# Altium project BQ79616-Q1_BMS_Slave.PrjPcb (part 2 of 2)

## Sheet Connectors.SchDoc
size A4; SheetNumber: 8; SheetTotal: 8
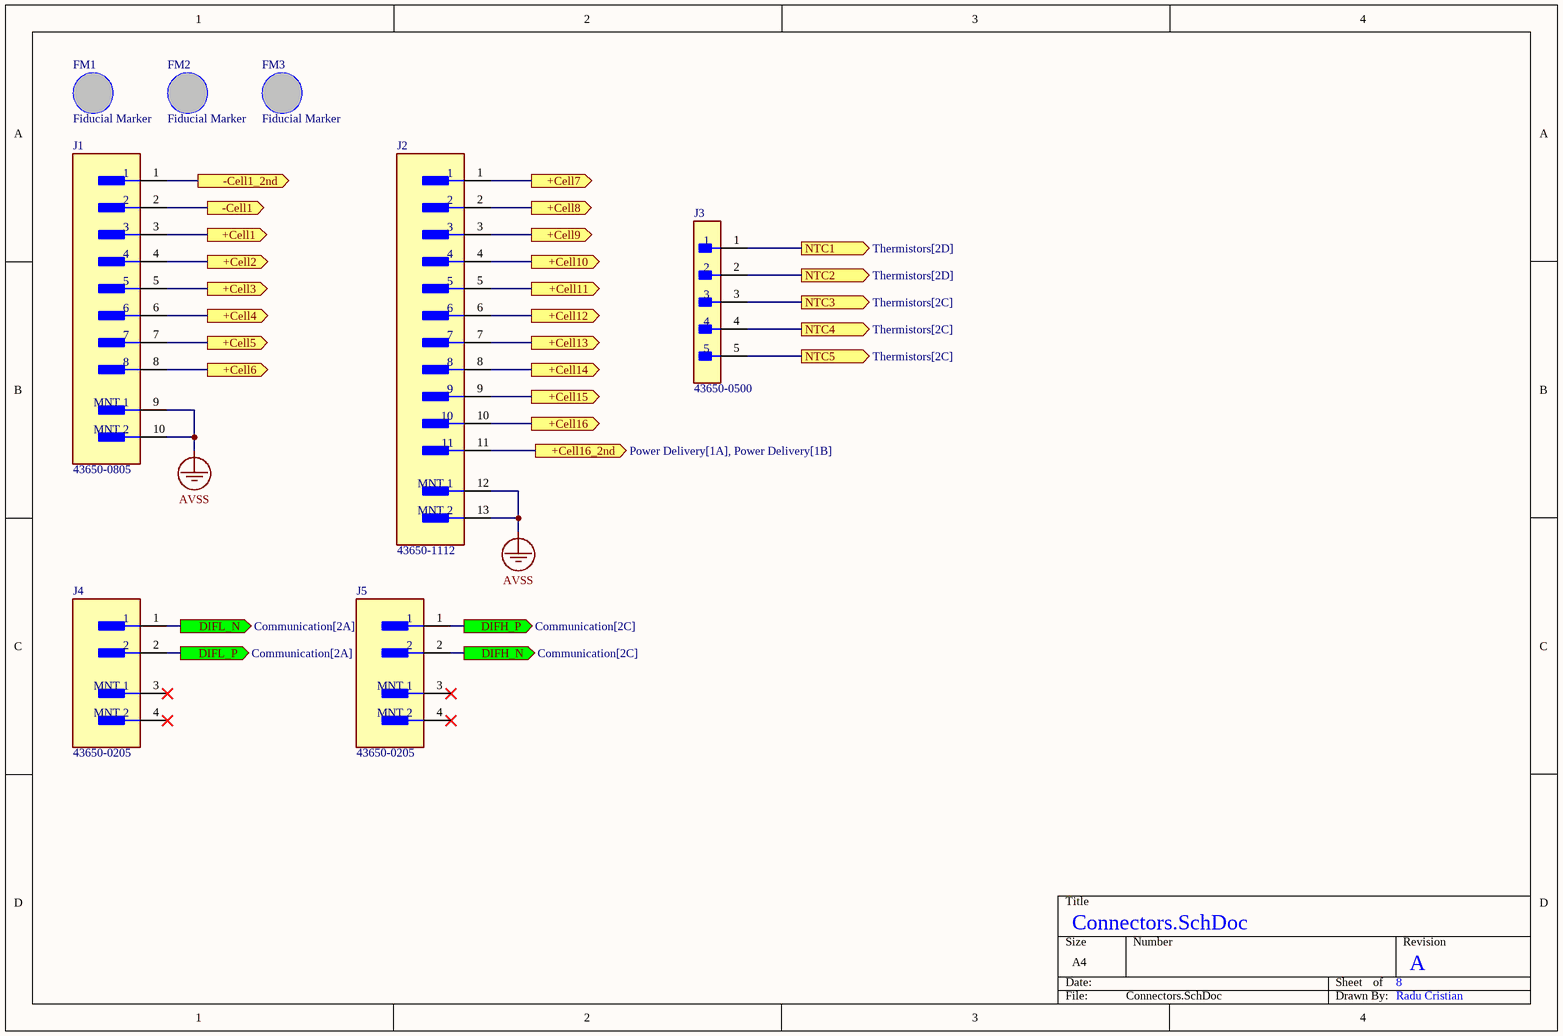
[diagram p7: Connectors.SchDoc]

### Parts
FM1  Fiducial Marker  [Fiducial Marker-Footprint-1]
FM2  Fiducial Marker  [Fiducial Marker-Footprint-1]
FM3  Fiducial Marker  [Fiducial Marker-Footprint-1]
J1  43650-0805  [FP-436500805-MFG]
J2  43650-1112  [FP-43650-1112-MFG]
J3  43650-0500  [FP-43650-0500-MFG]
J4  43650-0205  [FP-43650-0205-MFG]
J5  43650-0205  [FP-43650-0205-MFG]

### Ports
+Cell1 (out, see Cell Balancing[1D], Cell Voltage Sensing[1D]), +Cell2 (out, see Cell Balancing[1D], Cell Voltage Sensing[1D]), +Cell3 (out, see Cell Balancing[1C], Cell Voltage Sensing[1D]), +Cell4 (out, see Cell Balancing[1C], Cell Voltage Sensing[1C]), +Cell5 (out, see Cell Balancing[1C], Cell Voltage Sensing[1C]), +Cell6 (out, see Cell Balancing[1C], Cell Voltage Sensing[1C]), +Cell7 (out, see Cell Balancing[1C], Cell Voltage Sensing[1C]), +Cell8 (out, see Cell Balancing[1C], Cell Voltage Sensing[1C]), +Cell9 (out, see Cell Balancing[1B], Cell Voltage Sensing[1C]), +Cell10 (out, see Cell Balancing[1B], Cell Voltage Sensing[1B]), +Cell11 (out, see Cell Balancing[1B], Cell Voltage Sensing[1B]), +Cell12 (out, see Cell Balancing[1B], Cell Voltage Sensing[1B]), +Cell13 (out, see Cell Balancing[1B], Cell Voltage Sensing[1B]), +Cell14 (out, see Cell Balancing[1B], Cell Voltage Sensing[1B]), +Cell15 (out, see Cell Balancing[1B], Cell Voltage Sensing[1B]), +Cell16 (out, see Cell Balancing[1A], Cell Voltage Sensing[1B]), +Cell16_2nd (out, see Power Delivery[1A], Power Delivery[1B]), -Cell1 (out, see Cell Balancing[1D], Cell Voltage Sensing[1D]), -Cell1_2nd (out, see Power Delivery[2A]), DIFH_N (out, see Communication[2C]), DIFH_P (out, see Communication[2C]), DIFL_N (out, see Communication[2A]), DIFL_P (out, see Communication[2A]), NTC1 (out, see Thermistors[2D]), NTC2 (out, see Thermistors[2D]), NTC3 (out, see Thermistors[2C]), NTC4 (out, see Thermistors[2C]), NTC5 (out, see Thermistors[2C])

### Nets
AVSS: J1.1 J1.9(MNT_1) J1.10(MNT_2) J2.12(MNT_1) J2.13(MNT_2) ; port -Cell1_2nd
+Cell1: J1.3 ; port +Cell1
+Cell2: J1.4 ; port +Cell2
+Cell3: J1.5 ; port +Cell3
+Cell4: J1.6 ; port +Cell4
+Cell5: J1.7 ; port +Cell5
+Cell6: J1.8 ; port +Cell6
+Cell7: J2.1 ; port +Cell7
+Cell8: J2.2 ; port +Cell8
+Cell9: J2.3 ; port +Cell9
+Cell10: J2.4 ; port +Cell10
+Cell11: J2.5 ; port +Cell11
+Cell12: J2.6 ; port +Cell12
+Cell13: J2.7 ; port +Cell13
+Cell14: J2.8 ; port +Cell14
+Cell15: J2.9 ; port +Cell15
+Cell16: J2.10 ; port +Cell16
+Cell16_2nd: J2.11 ; port +Cell16_2nd
-Cell1: J1.2 ; port -Cell1
DIFH_N: J5.2 ; port DIFH_N
DIFH_P: J5.1 ; port DIFH_P
DIFL_N: J4.1 ; port DIFL_N
DIFL_P: J4.2 ; port DIFL_P
NTC1: J3.1 ; port NTC1
NTC2: J3.2 ; port NTC2
NTC3: J3.3 ; port NTC3
NTC4: J3.4 ; port NTC4
NTC5: J3.5 ; port NTC5

Not connected (* = marked no-connect by the designer): J4 3(MNT_1)* 4(MNT_2)*; J5 3(MNT_1)* 4(MNT_2)*

### Notes on the sheet
- Radu Cristian

### Library data of the parts
FM1-FM3 = CMP-00003-4: fancy style
J1 = CMP-002-00071-1: Header Connector, pcb Mount, recept, 8 Contacts, pin, 0.118 Pitch, pc Tail Terminal; Connector Type: Male Pin; Voltage Rating: 600V; Pins: 8; Max Operating Temperature: 105°C; Mounting Technology: Through Hole; Min Operating Temperature: -40°C
J2 = CMP-00257-00277522-1: 43650-1112 Conn Power HDR 11 POS 3mm Solder RA SMD 11 Terminal 1 Port Micro-Fit 3.0™ Embossed T/R; NexarPartId: 277522; Manufacturer Lifecycle Status: ACTIVE; Plating: Tin; Number of Circuits: 11; Connector Type: Male Pin; Gender: Male; Voltage Rating (DC): 250V; Voltage Rating: 600V; Glow Wire Compliant: Compliant; Current Rating: 5A; Orientation: Right Angle; Country of Origin: US; Lead Pitch: 3mm; Flammability Rating: UL94 V-0; Contact Material: Brass; Max Operating Temperature: 105°C; Min Operating Temperature: -40°C; Number of Contacts: 11; Number of Positions: 11; Pitch: 3mm; Housing Material: Polymer; Lifecycle Status: Production; Fastening Type: Ramp; Termination: Solder; RoHS: Compliant; Contact Gender: Male; Halogen Free: Low Halogen; Color: Black; Contact Plating: Tin; Number of Rows: 1; Lead Free: Contains Lead; Mount: Surface Mount; Housing Color: Black
J3 = CMP-04776-000912-1: CONN HEADER R/A 5POS 3MM; Manufacturer Series: 43650; Contact Resistance: 10mR; MIL Conformance: No; Number of Terminals/Pins: 5; Number of Rows Loaded: 1; Gender: Male; Current Rating: 5A; Option: General Purpose; Voltage Rating: 600V; Voltage Rating (DC): 250V; Glow Wire Compliant: Compliant; Additional Feature: POLARIZED; Contact Gender: Male; Mount: Through Hole; Series: 43650; Housing Material: Thermoplastic; Contact Material: Brass; Mixed Contacts: No; Max Operating Temperature: 105°C; Orientation: Right Angle; Package Quantity: 2023; Number of Rows: 1; Color: Black; Flammability Rating: UL94 V-0; Length: 18.65mm; Lead Free: Contains Lead; Housing Color: Black; Number of Circuits: 5; Number of Ports: 1; Mounting Style: RIGHT ANGLE; Radiation Hardening: No; IEC Conformance: No; Depth: 9.9mm; Min Operating Temperature: -40°C; Number of Contacts: 5; DIN Conformance: No; Filter Feature: No; Packaging: Tray; Contact Plating: Tin; RoHS Compliant: Yes; Number of Positions: 5; Halogen Free: Low Halogen; Termination: Solder; Pitch: 3mm
J4 J5 = CMP-00257-07672643-1: 43650-0205 Conn Wire to Board HDR 2 POS 3mm Solder RA Side Entry Thru-Hole Micro-Fit 3.0™ Tray; Manufacturer Lifecycle Status: ACTIVE; Plating: Tin; Glow Wire Compliant: Compliant; Number of Contacts: 2; Gender: Male; Voltage Rating: 600V; Current Rating: 5A; Lifecycle Status: Production; RoHS: Compliant; Number of Rows: 1; Housing Material: Thermoplastic; Country of Origin: US; Number of Circuits: 2; Halogen Free: Low Halogen; Orientation: Right Angle; Termination: Through Hole; Pitch: 3mm; Contact Material: Brass; Contact Plating: Gold; NexarPartId: 7672643; Number of Positions: 2

## Nets that join several sheets
AVSS: BQ chip (7 pins), Power Delivery (C4.1 C5.2 D2.1), Thermistors (17 pins), Communication (R69.1 R70.1), Connectors (5 pins)
BAT: BQ chip (IC1.1), Power Delivery (C4.2 R2.1), Cell Balancing (C7.2), Cell Voltage Sensing (C21.2)
CVDD: BQ chip (C2.1 IC1.45 IC1.52), Power Delivery (R5.2)
CVSS: BQ chip (C2.2 IC1.46), Power Delivery (C6.1), Communication (7 pins)
DVSS: BQ chip (C1.1 IC1.50), Communication (R70.2)
+Cell1: Cell Balancing (R18.2), Cell Voltage Sensing (R32.2), Connectors (J1.3)
+Cell2: Cell Balancing (R17.2), Cell Voltage Sensing (R31.2), Connectors (J1.4)
+Cell3: Cell Balancing (R16.2), Cell Voltage Sensing (R30.2), Connectors (J1.5)
+Cell4: Cell Balancing (R15.2), Cell Voltage Sensing (R29.2), Connectors (J1.6)
+Cell5: Cell Balancing (R14.2), Cell Voltage Sensing (R28.2), Connectors (J1.7)
+Cell6: Cell Balancing (R13.2), Cell Voltage Sensing (JMP*31.1 R27.2), Connectors (J1.8)
+Cell7: Cell Balancing (R12.2), Cell Voltage Sensing (JMP*29.1 JMP*31.2 R26.2), Connectors (J2.1)
+Cell8: Cell Balancing (R11.2), Cell Voltage Sensing (JMP*13.1 JMP*29.2 R25.2), Connectors (J2.2)
+Cell9: Cell Balancing (R10.2), Cell Voltage Sensing (JMP*11.1 JMP*13.2 R24.2), Connectors (J2.3)
+Cell10: Cell Balancing (R9.2), Cell Voltage Sensing (JMP*9.1 JMP*11.2 R23.2), Connectors (J2.4)
+Cell11: Cell Balancing (R8.2), Cell Voltage Sensing (JMP*7.1 JMP*9.2 R22.2), Connectors (J2.5)
+Cell12: Cell Balancing (R7.2), Cell Voltage Sensing (JMP*5.1 JMP*7.2 R21.2), Connectors (J2.6)
+Cell13: Cell Balancing (R6.2), Cell Voltage Sensing (JMP*5.2 JMP*27.1 R20.2), Connectors (J2.7)
+Cell14: Cell Balancing (R65.2), Cell Voltage Sensing (JMP*25.1 JMP*27.2 R68.2), Connectors (J2.8)
+Cell15: Cell Balancing (R64.2), Cell Voltage Sensing (JMP*23.1 JMP*25.2 R67.2), Connectors (J2.9)
+Cell16: Cell Balancing (R63.2), Cell Voltage Sensing (JMP*23.2 R66.2), Connectors (J2.10)
+Cell16_2nd: Power Delivery (R2.2 R3.1), Connectors (J2.11)
-Cell1: Cell Balancing (R19.2), Cell Voltage Sensing (R33.2), Connectors (J1.2)
CB0: BQ chip (IC1.34), Cell Balancing (C20.1 R19.1)
CB1: BQ chip (IC1.32), Cell Balancing (C19.1 C20.2 R18.1)
CB2: BQ chip (IC1.30), Cell Balancing (C18.1 C19.2 R17.1)
CB3: BQ chip (IC1.28), Cell Balancing (C17.1 C18.2 R16.1)
CB4: BQ chip (IC1.26), Cell Balancing (C16.1 C17.2 R15.1)
CB5: BQ chip (IC1.24), Cell Balancing (C15.1 C16.2 R14.1)
CB6: BQ chip (IC1.22), Cell Balancing (C14.1 C15.2 JMP*19.1 R13.1)
CB7: BQ chip (IC1.20), Cell Balancing (5 pins)
CB8: BQ chip (IC1.18), Cell Balancing (5 pins)
CB9: BQ chip (IC1.16), Cell Balancing (5 pins)
CB10: BQ chip (IC1.14), Cell Balancing (5 pins)
CB11: BQ chip (IC1.12), Cell Balancing (5 pins)
CB12: BQ chip (IC1.10), Cell Balancing (5 pins)
CB13: BQ chip (IC1.8), Cell Balancing (5 pins)
CB14: BQ chip (IC1.6), Cell Balancing (5 pins)
CB15: BQ chip (IC1.4), Cell Balancing (5 pins)
CB16: BQ chip (IC1.2), Cell Balancing (C7.1 C51.2 JMP*15.2 R63.1)
COMH_N: BQ chip (IC1.42), Communication (C49.2 R61.2 R62.1)
COMH_P: BQ chip (IC1.43), Communication (C48.1 R60.1 R61.1)
COML_N: BQ chip (IC1.41), Communication (C44.1 R57.1 R58.1)
COML_P: BQ chip (IC1.40), Communication (C45.2 R58.2 R59.1)
DIFH_N: Communication (L2.3), Connectors (J5.2)
DIFH_P: Communication (L2.4), Connectors (J5.1)
DIFL_N: Communication (L1.4), Connectors (J4.1)
DIFL_P: Communication (L1.3), Connectors (J4.2)
GPIO1: BQ chip (IC1.61), Thermistors (C42.1 R51.2)
GPIO2: BQ chip (IC1.60), Thermistors (C41.1 R50.2)
GPIO3: BQ chip (IC1.59), Thermistors (C40.1 R49.2)
GPIO4: BQ chip (IC1.58), Thermistors (C39.1 R48.2)
GPIO5: BQ chip (IC1.57), Thermistors (C38.1 R47.2)
GPIO6: BQ chip (IC1.56), Thermistors (C37.1 R37.2)
GPIO7: BQ chip (IC1.55), Thermistors (C36.1 R36.2)
LDOIN: BQ chip (IC1.47), Power Delivery (C6.2 Q1.3)
NPNB: BQ chip (IC1.48), Power Delivery (Q1.1)
NTC1: Thermistors (R46.1 R51.1 R56.2), Connectors (J3.1)
NTC2: Thermistors (R45.1 R50.1 R55.2), Connectors (J3.2)
NTC3: Thermistors (R44.1 R49.1 R54.2), Connectors (J3.3)
NTC4: Thermistors (R43.1 R48.1 R53.2), Connectors (J3.4)
NTC5: Thermistors (R42.1 R47.1 R52.2), Connectors (J3.5)
TSREF: BQ chip (IC1.51), Thermistors (8 pins)
VC0: BQ chip (IC1.35), Cell Voltage Sensing (C34.1 R33.1)
VC1: BQ chip (IC1.33), Cell Voltage Sensing (C33.1 C34.2 R32.1)
VC2: BQ chip (IC1.31), Cell Voltage Sensing (C32.1 C33.2 R31.1)
VC3: BQ chip (IC1.29), Cell Voltage Sensing (C31.1 C32.2 R30.1)
VC4: BQ chip (IC1.27), Cell Voltage Sensing (C30.1 C31.2 R29.1)
VC5: BQ chip (IC1.25), Cell Voltage Sensing (C29.1 C30.2 R28.1)
VC6: BQ chip (IC1.23), Cell Voltage Sensing (C28.1 C29.2 JMP*32.1 R27.1)
VC7: BQ chip (IC1.21), Cell Voltage Sensing (5 pins)
VC8: BQ chip (IC1.19), Cell Voltage Sensing (5 pins)
VC9: BQ chip (IC1.17), Cell Voltage Sensing (5 pins)
VC10: BQ chip (IC1.15), Cell Voltage Sensing (5 pins)
VC11: BQ chip (IC1.13), Cell Voltage Sensing (5 pins)
VC12: BQ chip (IC1.11), Cell Voltage Sensing (5 pins)
VC13: BQ chip (IC1.9), Cell Voltage Sensing (5 pins)
VC14: BQ chip (IC1.7), Cell Voltage Sensing (5 pins)
VC15: BQ chip (IC1.5), Cell Voltage Sensing (5 pins)
VC16: BQ chip (IC1.3), Cell Voltage Sensing (C21.1 C54.2 JMP*24.2 R66.1)